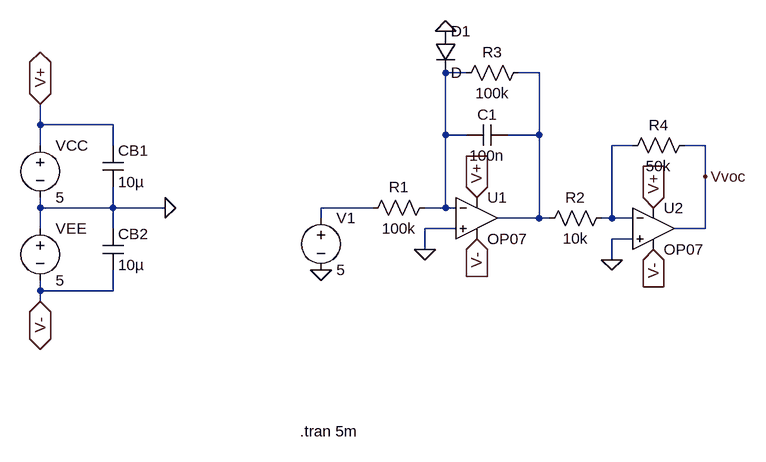
[diagram p0: schematic Voltage ramp.asc]
Voltage ramp.asc, the LTspice schematic file:
Version 4
SHEET 1 880 680
WIRE 192 -176 160 -176
WIRE 304 -176 272 -176
WIRE -464 -96 -464 -128
WIRE -352 -96 -464 -96
WIRE 160 -80 160 -176
WIRE 192 -80 160 -80
WIRE 304 -80 304 -176
WIRE 304 -80 256 -80
WIRE -464 -64 -464 -96
WIRE -352 -64 -352 -96
WIRE 448 -64 416 -64
WIRE 560 -64 528 -64
WIRE 560 -16 560 -64
WIRE -464 32 -464 16
WIRE -352 32 -352 0
WIRE -352 32 -464 32
WIRE -272 32 -352 32
WIRE 48 32 -32 32
WIRE 160 32 160 -80
WIRE 160 32 128 32
WIRE 176 32 160 32
WIRE -32 48 -32 32
WIRE 304 48 304 -80
WIRE 304 48 240 48
WIRE 320 48 304 48
WIRE 416 48 416 -64
WIRE 416 48 400 48
WIRE 448 48 416 48
WIRE -464 64 -464 32
WIRE -352 64 -352 32
WIRE 176 64 128 64
WIRE 560 64 560 -16
WIRE 560 64 512 64
WIRE 448 80 416 80
WIRE 128 96 128 64
WIRE 416 112 416 80
WIRE -464 160 -464 144
WIRE -352 160 -352 128
WIRE -352 160 -464 160
WIRE -464 176 -464 160
FLAG -272 32 0
FLAG -464 -128 V+
IOPIN -464 -128 BiDir
FLAG -464 176 V-
IOPIN -464 176 BiDir
FLAG 128 96 0
FLAG 208 80 V-
IOPIN 208 80 In
FLAG 208 16 V+
IOPIN 208 16 In
FLAG -32 128 0
FLAG 480 96 V-
IOPIN 480 96 In
FLAG 480 32 V+
IOPIN 480 32 In
FLAG 560 -16 Vvoc
FLAG 416 112 0
FLAG 160 -240 0
SYMBOL voltage -464 -80 R0
SYMATTR InstName VCC
SYMATTR Value 5
SYMBOL voltage -464 48 R0
SYMATTR InstName VEE
SYMATTR Value 5
SYMBOL Cap -368 -64 R0
SYMATTR InstName CB1
SYMATTR Value 10µ
SYMBOL Cap -368 64 R0
SYMATTR InstName CB2
SYMATTR Value 10µ
SYMBOL OpAmps/OP07 208 -16 R0
SYMATTR InstName U1
SYMBOL Voltage -32 32 R0
SYMATTR InstName V1
SYMATTR Value 5
SYMBOL Res 144 16 R90
WINDOW 0 0 56 VBottom 2
WINDOW 3 32 56 VTop 2
SYMATTR InstName R1
SYMATTR Value 100k
SYMBOL Cap 256 -96 R90
WINDOW 0 0 32 VBottom 2
WINDOW 3 32 32 VTop 2
SYMATTR InstName C1
SYMATTR Value 100n
SYMATTR SpiceLine IC=0
SYMBOL Res 288 -192 R90
WINDOW 0 0 56 VBottom 2
WINDOW 3 32 56 VTop 2
SYMATTR InstName R3
SYMATTR Value 100k
SYMBOL OpAmps/OP07 480 0 R0
SYMATTR InstName U2
SYMBOL Res 416 32 R90
WINDOW 0 0 56 VBottom 2
WINDOW 3 32 56 VTop 2
SYMATTR InstName R2
SYMATTR Value 10k
SYMBOL Res 544 -80 R90
WINDOW 0 0 56 VBottom 2
WINDOW 3 32 56 VTop 2
SYMATTR InstName R4
SYMATTR Value 50k
SYMBOL Diode 144 -240 R0
SYMATTR InstName D1
TEXT -64 376 Left 2 !.tran 5m

The netlist it stands for:
* Voltage ramp.asc
VCC V+ 0 5
VEE 0 V- 5
CB1 V+ 0 10µ
CB2 0 V- 10µ
XU1 0 N001 V+ V- N002 LT1001  ; OP07, pins In+ In- V+ V- OUT
V1 N004 0 5
R1 N001 N004 100k
C1 N002 N001 100n IC=0
R3 N002 N001 100k
XU2 0 N003 V+ V- Vvoc LT1001  ; OP07, pins In+ In- V+ V- OUT
R2 N003 N002 10k
R4 Vvoc N003 50k
D1 0 N001 D
.model D D
.lib standard.dio
.tran 5m
.lib LTC.lib
.backanno
.end